# EAGLE design Schaltplan (EAGLE 6.5.0)
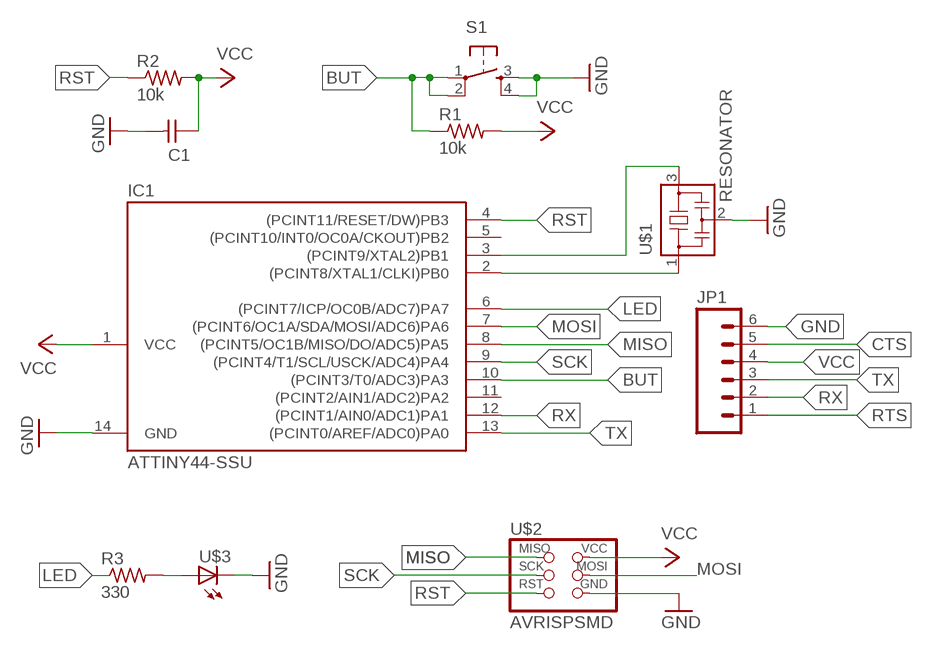
[diagram p0: schematic, sheet 1]

## Parts
C1  UNPOLARIZED_CAPACITOR1206  [1206]
IC1  ATTINY44-SSU  [SOIC14]
JP1  M06SMD  [1X06-SMD]
R1  10k  RESISTOR1206  [1206]
R2  10k  RESISTOR1206  [1206]
R3  330  RESISTOR1206  [1206]
S1  6MM_SWITCH6MM_SWITCH  [6MM_SWITCH]
U$1  RESONATOR  [EFOBM]
U$2  AVRISPSMD  [2X03SMD]
U$3  LED1206  [1206]

## Nets
BUT: IC1.10((PCINT3/T0/ADC3)PA3) R1.1 S1.1(P) S1.2(P1)
CTS: JP1.5
GND: C1.2 IC1.14(GND) JP1.6 S1.3(S) S1.4(S1) U$1.2 U$2.6(GND) U$3.2(C)
LED: IC1.6((PCINT7/ICP/OC0B/ADC7)PA7) R3.1
MISO: IC1.8((PCINT5/OC1B/MISO/DO/ADC5)PA5) U$2.1(MISO)
MOSI: IC1.7((PCINT6/OC1A/SDA/MOSI/ADC6)PA6) U$2.4(MOSI)
N$1: IC1.2((PCINT8/XTAL1/CLKI)PB0) U$1.1
N$3: IC1.3((PCINT9/XTAL2)PB1) U$1.3
N$4: R3.2 U$3.1(A)
RST: IC1.4((PCINT11/RESET/DW)PB3) R2.1 U$2.5(RST)
RTS: JP1.1
RX: IC1.12((PCINT1/AIN0/ADC1)PA1) JP1.2
SCK: IC1.9((PCINT4/T1/SCL/USCK/ADC4)PA4) U$2.3(SCK)
TX: IC1.13((PCINT0/AREF/ADC0)PA0) JP1.3
VCC: C1.1 IC1.1(VCC) JP1.4 R1.2 R2.2 U$2.2(VCC)
Unconnected: IC1.5((PCINT10/INT0/OC0A/CKOUT)PB2) IC1.11((PCINT2/AIN1/ADC2)PA2)

## Library data of the parts
C1 = 01_FAB_Hello:UNPOLARIZED_CAPACITOR: unpolarized_capacitor
IC1 = 01_FAB_Hello:ATTINY44
JP1 = 01_SparkFun:M06: Header 6 Standard 6-pin 0.1" header. Use with straight break away headers (SKU : PRT-00116), right angle break away headers (PRT-00553), swiss pins (PRT-00743), machine pins (PRT-00117), and female headers (PRT-00115). Molex polarized connector foot print use with SKU : PRT-08094 with associated crimp pins and housings. NOTES ON THE VARIANTS LOCK and LOCK_LONGPADS... This footprint was designed to help hold the alignment of a through-hole component (i.e. 6-pin header) while soldering it into place. You may notice that each hole has been shifted either up or down by 0.005 of an inch from it's more standard position (which is a perfectly straight line). This slight alteration caused the pins (the squares in the middle) to touch the edges of the holes. Because they are alternating, it causes a "brace" to hold the component in place. 0.005 has proven to be the perfect amount of "off-center" position when using our standard breakaway headers. Although looks a little odd when you look at the bare footprint, once you have a header in there, the alteration is very hard to notice. Also, if you push a header all the way into place, it is covered up entirely on the bottom side. This idea of altering the position of holes to aid alignment will be further integrated into the Sparkfun Library for other footprints. It can help hold any component with 3 or more connection pins.
R1-R3 = 01_FAB_Hello:RESISTOR
S1 = 01_FAB_Hello:6MM_SWITCH: OMRON SWITCH
U$1 = 01_fab:RESONATOR
U$2 = 01_FAB_Hello:AVRISP
U$3 = 01_FAB_Hello:LED

## Board
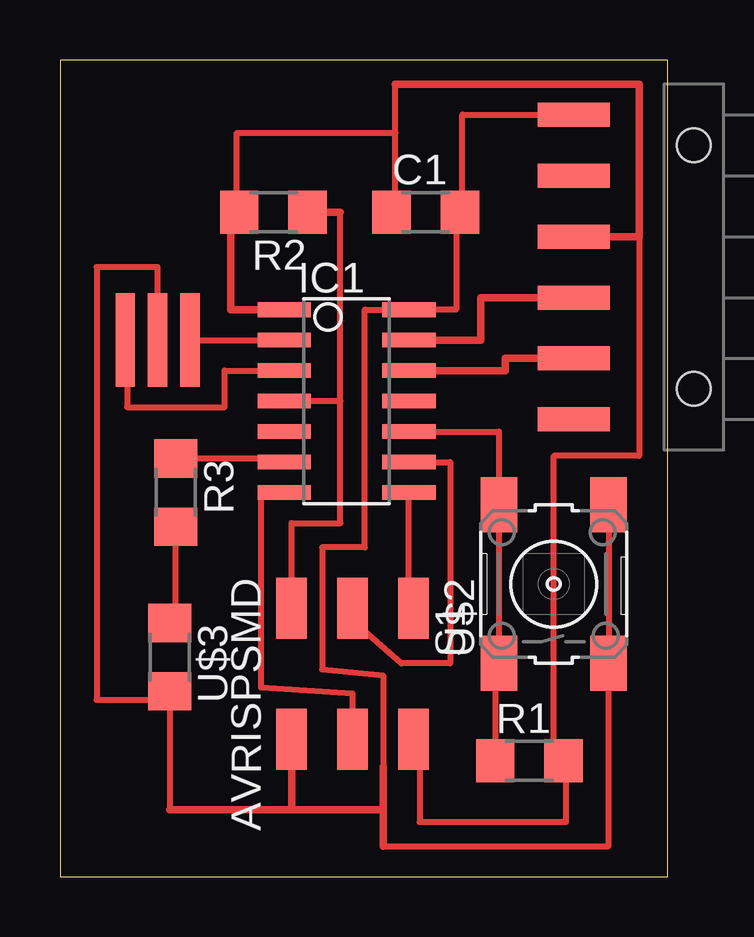
[diagram p1: board, top side]

Size 25.32 x 34.03 mm. Coordinates in mm from the lower left corner, seen from the top.
Outline: 0,0 25.32,0 25.32,34.03 0,34.03 0,0
Copper layers (1*16): Top 0.035mm / dielectric 1.5mm / Bottom 0.035mm
Design rules "default": minimum track width 10mil, minimum drill 24mil, track to track 8mil, track to pad 8mil, pad to pad 8mil, via to via 8mil, smd to smd 8mil, copper to edge 40mil, drill to drill 8mil, minimum pad ring 10mil, minimum via ring 8mil, stop-mask expansion 4mil, vias tented up to drill 0mil, thermal gap 10mil

### Footprints (pad centres in the part's own frame; a part is rotated, then mirrored left to right if it is on the bottom)
1206 = smd 1.6 x 1.803: 1 -1.422,0; 2 1.422,0
SOIC14 = smd 0.61 x 2.21: 1 -3.81,-2.603; 2 -2.54,-2.603; 3 -1.27,-2.603; 4 0,-2.603; 5 1.27,-2.603; 6 2.54,-2.603; 7 3.81,-2.603; 8 3.81,2.603; 9 2.54,2.603; 10 1.27,2.603; 11 0,2.603; 12 -1.27,2.603; 13 -2.54,2.603; 14 -3.81,2.603
1X06-SMD = smd 1 x 3: 1 -6.35,5; 2 -3.81,5; 3 -1.27,5; 4 1.27,5; 5 3.81,5; 6 6.35,5 | hole 1.4: -5.08,0; 5.08,0
6MM_SWITCH = smd 2.286 x 1.524: 1 -3.302,2.286; 2 3.302,2.286; 3 -3.302,-2.286; 4 3.302,-2.286
EFOBM = smd 0.8 x 3.9: 1 -1.35,0; 2 0,0; 3 1.35,0
2X03SMD = smd 2.54 x 1.27: 1 -2.54,2.54; 2 2.92,2.54; 3 -2.54,0; 4 2.92,0; 5 -2.54,-2.54; 6 2.92,-2.54

### Placement (x,y rotation side)
C1  15.24,27.69 0 top
IC1  11.94,19.81 270 top
JP1  26.42,25.4 90 top
R1  19.56,4.83 0 top
R2  8.89,27.69 180 top
R3  4.83,16 270 top
S1  20.57,12.19 90 top
U$1  4.06,22.35 180 top
U$2  12.19,8.64 270 top
U$3  4.57,9.14 270 top

### Tracks (layer width: path | path; a pad name or v marks a point on that pad's centre or on a via)
BUT
  Top 0.254: IC1.10 18.29,18.54 S1.2 S1.1 18.14,8.89 R1.1
GND
  Top 0.254: 13.46,4.57 13.46,8.38 10.92,8.64 10.92,13.72 12.7,13.72 12.7,23.62 13.46,23.62 | JP1.6 16.76,31.75 16.76,27.69 C1.2 16.51,27.69 16.51,23.62 IC1.14 | 4.57,2.79 U$3.2 4.57,7.37 1.52,7.37 1.52,25.4 4.06,25.4 U$1.2 | S1.4 S1.3 22.86,1.27 13.46,1.27
  Top 0.305: 4.57,2.79 9.65,2.79 | 9.65,2.79 13.46,2.79 | 13.46,2.79 13.46,4.57 | 13.46,1.27 13.46,2.79 | U$2.6 9.65,2.79 | 13.46,23.62 IC1.14
LED
  Top 0.254: R3.1 9.33,17.42 IC1.6
MISO
  Top 0.254: U$2.1 14.54,11.18 IC1.8
MOSI
  Top 0.254: U$2.4 12.19,7.62 8.38,7.87 8.38,16 IC1.7
N$1
  Top 0.254: U$1.1 IC1.2
N$3
  Top 0.254: U$1.3 2.79,22.35 2.79,19.56 6.86,19.56 6.86,21.08 IC1.3
N$4
  Top 0.254: U$3.1 4.83,10.57 R3.2
RST
  Top 0.254: 11.68,19.81 11.68,14.73 9.65,14.73 U$2.5 | 11.68,19.81 11.68,27.69 | 11.68,19.81 IC1.4
  Top 0.305: 11.68,27.69 R2.1
RX
  Top 0.305: IC1.12 18.54,21.08 18.54,21.59 JP1.2
SCK
  Top 0.254: IC1.9 16.26,17.27 16.26,8.89 14.22,8.89 12.19,10.67 U$2.3
TX
  Top 0.305: IC1.13 17.53,22.35 17.53,24.13 JP1.3
VCC
  Top 0.254: C1.1 13.97,27.69 13.97,30.99 | 13.97,30.99 13.97,33.02 | R2.2 7.37,27.69 7.37,30.99 13.97,30.99 | U$2.2 14.99,6.48 14.99,2.29 21.08,2.29 21.08,4.83 R1.2 20.57,4.83 20.57,17.53 24.13,17.53 24.13,26.67
  Top 0.305: R2.2 7.11,27.69 7.11,23.62 IC1.1 | JP1.4 24.13,26.67 24.13,33.02 13.97,33.02